# Altium schematic sheet TMC5161_StepperDriver.SchDoc
size Letter
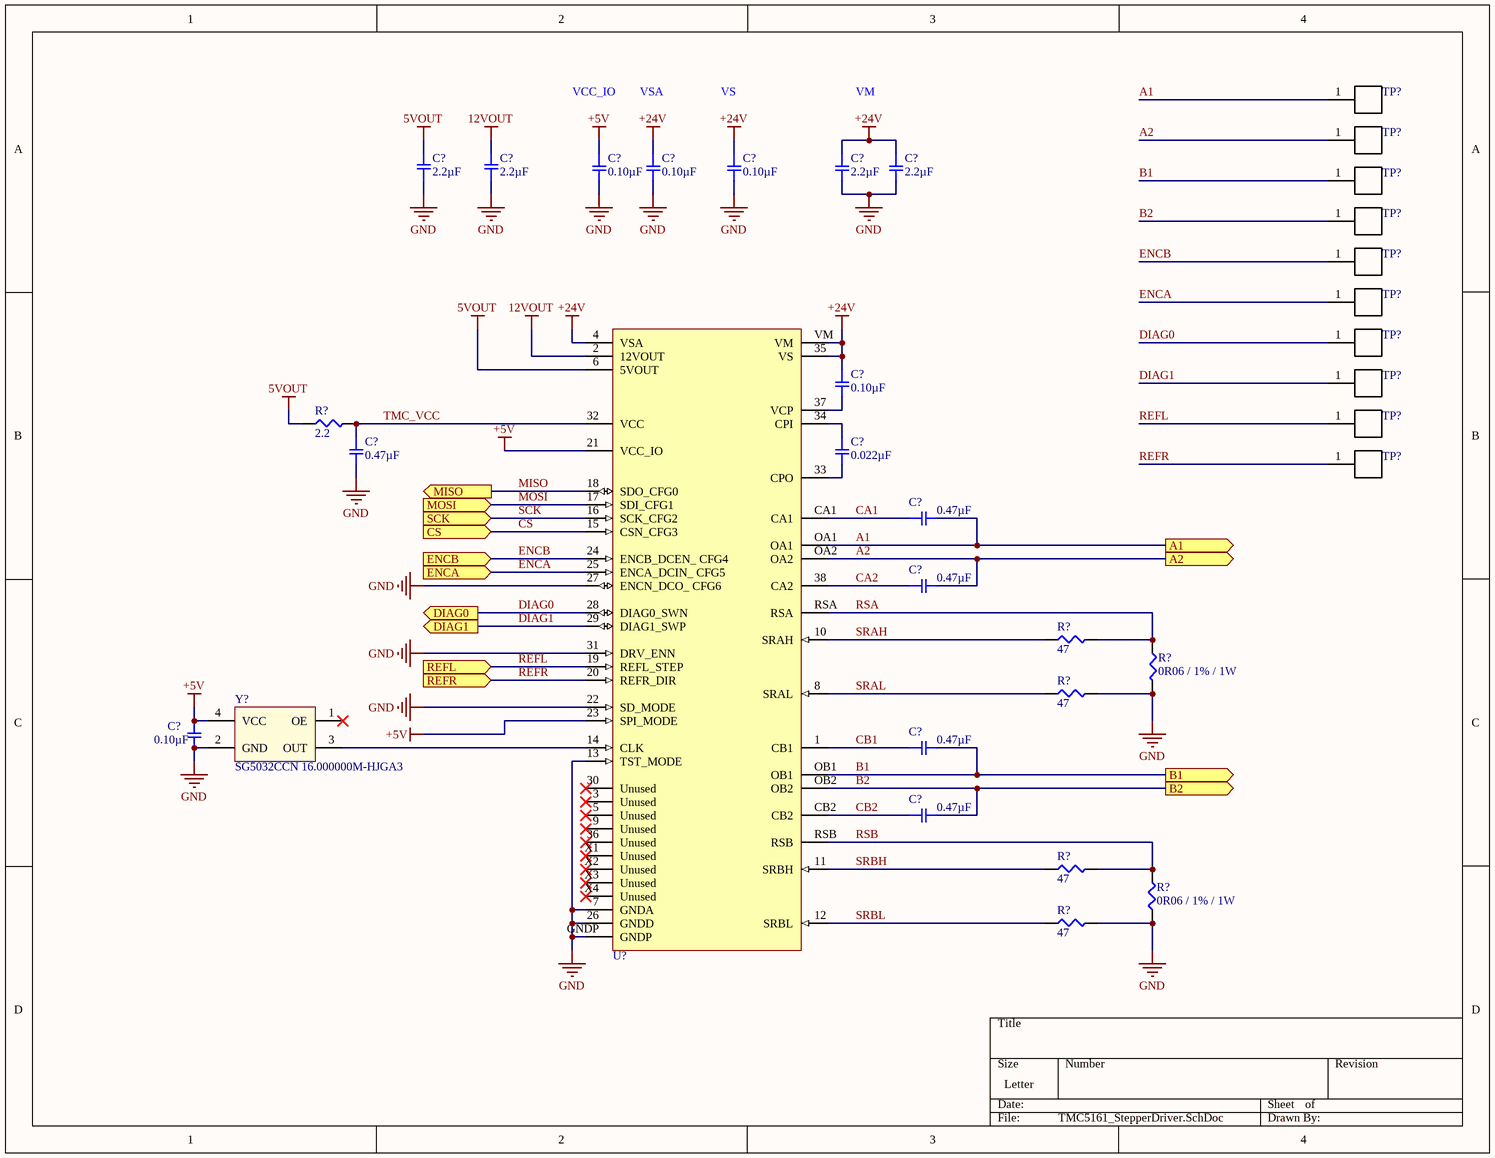
[diagram p0: TMC5161_StepperDriver.SchDoc]

## Parts
(Parts that share a designator on the sheet are numbered #1, #2 ... from top to bottom, then left to right.)
C?#1  2.2µF  [SMD-0603C]
C?#2  2.2µF  [SMD-0603C]
C?#3  0.10µF  [SMD-0603C]
C?#4  0.10µF  [SMD-0603C]
C?#5  0.10µF  [SMD-0603C]
C?#6  2.2µF  [SMD-0805C]
C?#7  2.2µF  [SMD-0805C]
C?#8  0.10µF  [SMD-0603C]
C?#9  0.47µF  [SMD-0603C]
C?#10  0.022µF  [SMD-0603C]
C?#11  0.47µF  [SMD-0603C]
C?#12  0.47µF  [SMD-0603C]
C?#13  0.10µF  [SMD-0603C]
C?#14  0.47µF  [SMD-0603C]
C?#15  0.47µF  [SMD-0603C]
R?#1  2.2  [SMD-0603-RES]
R?#2  47  [SMD-0603-RES]
R?#3  0R06 / 1% / 1W  [Resistor_2512]
R?#4  47  [SMD-0603-RES]
R?#5  47  [SMD-0603-RES]
R?#6  0R06 / 1% / 1W  [Resistor_2512]
R?#7  47  [SMD-0603-RES]
TP?#1  A1  [TE_RCU-0C]  (value not drawn)
TP?#2  A2  [TE_RCU-0C]  (value not drawn)
TP?#3  B1  [TE_RCU-0C]  (value not drawn)
TP?#4  B2  [TE_RCU-0C]  (value not drawn)
TP?#5  ENCB  [TE_RCU-0C]  (value not drawn)
TP?#6  ENCA  [TE_RCU-0C]  (value not drawn)
TP?#7  DIAG0  [TE_RCU-0C]  (value not drawn)
TP?#8  DIAG1  [TE_RCU-0C]  (value not drawn)
TP?#9  REFL  [TE_RCU-0C]  (value not drawn)
TP?#10  REFR  [TE_RCU-0C]  (value not drawn)
U?  TMC5161  [TMC5161-HH]  (value not drawn)
Y?  SG5032CCN 16.000000M-HJGA3  [SG5032CCN_16.000000M-HJGA3]

## Ports
A1 (out), A2 (out), B1 (out), B2 (out), CS (in), DIAG0 (out), DIAG1 (out), ENCA (in), ENCB (in), MISO (out), MOSI (in), REFL (in), REFR (in), SCK (in)

## Nets
5VOUT: C?#1.2 R?#1.1 U?.6(5VOUT)
12VOUT: C?#2.2 U?.2(12VOUT)
+5V: C?#3.1 C?#13.1 U?.21(VCC_IO) U?.23(SPI_MODE) Y?.4(VCC)
+24V: C?#4.1 C?#5.1 C?#6.1 C?#7.1 C?#8.1 U?.4(VSA) U?.35(VS) U?.VM
GND: C?#1.1 C?#2.1 C?#3.2 C?#4.2 C?#5.2 C?#6.2 C?#7.2 C?#9.2 C?#13.2 R?#3.2 R?#4.2 R?#6.1 R?#7.2 U?.7(GNDA) U?.13(TST_MODE) U?.22(SD_MODE) U?.26(GNDD) U?.27(ENCN_DCO__CFG6) U?.31(DRV_ENN) U?.GNDP Y?.2(GND)
A1: C?#11.2 TP?#1.1 U?.OA1 ; port A1
A2: C?#12.2 TP?#2.1 U?.OA2 ; port A2
B1: C?#14.2 TP?#3.1 U?.OB1 ; port B1
B2: C?#15.2 TP?#4.1 U?.OB2 ; port B2
CA1: C?#11.1 U?.CA1
CA2: C?#12.1 U?.38(CA2)
CB1: C?#14.1 U?.1(CB1)
CB2: C?#15.1 U?.CB2
CS: U?.15(CSN_CFG3) ; port CS
DIAG0: TP?#7.1 U?.28(DIAG0_SWN) ; port DIAG0
DIAG1: TP?#8.1 U?.29(DIAG1_SWP) ; port DIAG1
ENCA: TP?#6.1 U?.25(ENCA_DCIN__CFG5) ; port ENCA
ENCB: TP?#5.1 U?.24(ENCB_DCEN__CFG4) ; port ENCB
MISO: U?.18(SDO_CFG0) ; port MISO
MOSI: U?.17(SDI_CFG1) ; port MOSI
REFL: TP?#9.1 U?.19(REFL_STEP) ; port REFL
REFR: TP?#10.1 U?.20(REFR_DIR) ; port REFR
RSA: R?#2.2 R?#3.1 U?.RSA
RSB: R?#5.2 R?#6.2 U?.RSB
SCK: U?.16(SCK_CFG2) ; port SCK
SRAH: R?#2.1 U?.10(SRAH)
SRAL: R?#4.1 U?.8(SRAL)
SRBH: R?#5.1 U?.11(SRBH)
SRBL: R?#7.1 U?.12(SRBL)
TMC_VCC: C?#9.1 R?#1.2 U?.32(VCC)
NetC?#8_2: C?#8.2 U?.37(VCP)
NetC?#10_1: C?#10.1 U?.34(CPI)
NetC?#10_2: C?#10.2 U?.33(CPO)
NetU?_14: U?.14(CLK) Y?.3(OUT)

Not connected (* = marked no-connect by the designer): U? 3(Unused)* 5(Unused)* 9(Unused)* 30(Unused)* 36(Unused)* X1(Unused)* X2(Unused)* X3(Unused)* X4(Unused)*; Y? 1(OE)*

## Notes on the sheet
- VCC_IO
- VSA
- VS
- VM

## Library data of the parts
C?#1 C?#2 = GRM188C71E225KE11D: CAP CER 2.2UF 25V X7S 0603; Manufacturer: Murata Electronics North America; Factory Stock: 0; Unit Price (USD): 0.25; Minimum Quantity: 1; Tolerance: ±10%; Datasheets: http://www.murata.com/~/media/webrenewal/support/library/catalog/products/capacitor/mlcc/c02e.pdf; Image: //media.digikey.com/Renders/Murata%20Renders/ZRB-SERIES-0402.jpg; Digi-Key Part Number: 490-12732-1-ND; Part Number: GRM188C71E225KE11D; Quantity Available: 14750; @ qty: 0; Packaging: Cut Tape (CT); Series: GRM; Part Status: Active; Value: 2.2µF; Voltage: 25V; Temperature Coefficient: X7S; Operating Temperature: -55°C ~ 125°C; Features: -; Ratings: -; Applications: General Purpose; Mounting Type: Surface Mount, MLCC; Package / Case: 0603 (1608 Metric); Size / Dimension: 0.063" L x 0.031" W (1.60mm x 0.80mm); Height - Seated (Max): -; Thickness (Max): 0.039" (1.00mm); Lead Spacing: -; Lead Style: -
C?#3-C?#5 C?#8 C?#13 = GCJ188R71H104KA12D: CAP CER 0.1UF 50V X7R 0603; Manufacturer: Murata Electronics North America; Factory Stock: 0; Unit Price (USD): 0.12; Minimum Quantity: 1; Tolerance: ±10%; Datasheets: http://www.murata.com/~/media/webrenewal/support/library/catalog/products/capacitor/mlcc/c03e.ashx; Image: //media.digikey.com/Renders/Murata%20Renders/0603%28LQG18%29.jpg; Digi-Key Part Number: 490-5798-1-ND; Part Number: GCJ188R71H104KA12D; Quantity Available: 163695; @ qty: 0; Packaging: Cut Tape (CT); Series: GCJ; Part Status: Active; Value: 0.10µF; Voltage: 50V; Temperature Coefficient: X7R; Operating Temperature: -55°C ~ 125°C; Features: Soft Termination; Ratings: AEC-Q200; Applications: Automotive, Boardflex Sensitive; Mounting Type: Surface Mount, MLCC; Package / Case: 0603 (1608 Metric); Size / Dimension: 0.063" L x 0.031" W (1.60mm x 0.80mm); Height - Seated (Max): -; Thickness (Max): 0.035" (0.90mm); Lead Spacing: -; Lead Style: -
C?#6 C?#7 = GRM21BR61H225KA73L: CAP CER 2.2UF 50V X5R 0805; Manufacturer: Murata Electronics North America; Factory Stock: 0; Unit Price (USD): 0.29; Minimum Quantity: 1; Tolerance: ±10%; Datasheets: http://www.murata.com/~/media/webrenewal/support/library/catalog/products/capacitor/mlcc/c02e.pdf; Image: //media.digikey.com/Renders/Murata%20Renders/0805%20(2012%20Metric)%20.85mm.jpg; Digi-Key Part Number: 490-10750-1-ND; Part Number: GRM21BR61H225KA73L; Quantity Available: 36370; @ qty: 0; Packaging: Cut Tape (CT); Series: GRM; Part Status: Active; Value: 2.2µF; Voltage: 50V; Temperature Coefficient: X5R; Operating Temperature: -55°C ~ 85°C; Features: -; Ratings: -; Applications: General Purpose; Mounting Type: Surface Mount, MLCC; Package / Case: 0805 (2012 Metric); Size / Dimension: 0.079" L x 0.049" W (2.00mm x 1.25mm); Height - Seated (Max): -; Thickness (Max): 0.055" (1.40mm); Lead Spacing: -; Lead Style: -
C?#9 C?#11 C?#12 C?#14 C?#15 = GCJ188R71C474KA12D: CAP CER 0.47UF 16V X7R 0603; Manufacturer: Murata Electronics North America; Factory Stock: 0; Unit Price (USD): 0.18; Minimum Quantity: 1; Tolerance: ±10%; Datasheets: http://www.murata.com/~/media/webrenewal/support/library/catalog/products/capacitor/mlcc/c03e.ashx; Image: //media.digikey.com/Renders/Murata%20Renders/0603%28LQG18%29.jpg; Digi-Key Part Number: 490-5812-1-ND; Part Number: GCJ188R71C474KA12D; Quantity Available: 26222; @ qty: 0; Packaging: Cut Tape (CT); Series: GCJ; Part Status: Active; Value: 0.47µF; Voltage: 16V; Temperature Coefficient: X7R; Operating Temperature: -55°C ~ 125°C; Features: Soft Termination; Ratings: AEC-Q200; Applications: Automotive, Boardflex Sensitive; Mounting Type: Surface Mount, MLCC; Package / Case: 0603 (1608 Metric); Size / Dimension: 0.063" L x 0.031" W (1.60mm x 0.80mm); Height - Seated (Max): -; Thickness (Max): 0.031" (0.80mm); Lead Spacing: -; Lead Style: -
C?#10 = GCJ188R71H223KA01D: CAP CER 0.022UF 50V X7R 0603; Manufacturer: Murata Electronics North America; Factory Stock: 0; Unit Price (USD): 0.22; Minimum Quantity: 1; Tolerance: ±10%; Datasheets: http://www.murata.com/~/media/webrenewal/support/library/catalog/products/capacitor/mlcc/c03e.ashx; Image: //media.digikey.com/Renders/Murata%20Renders/0603%28LQG18%29.jpg; Digi-Key Part Number: 490-5851-1-ND; Part Number: GCJ188R71H223KA01D; Quantity Available: 7651; @ qty: 0; Packaging: Cut Tape (CT); Series: GCJ; Part Status: Active; Value: 0.022µF; Voltage: 50V; Temperature Coefficient: X7R; Operating Temperature: -55°C ~ 125°C; Features: Soft Termination; Ratings: AEC-Q200; Applications: Automotive, Boardflex Sensitive; Mounting Type: Surface Mount, MLCC; Package / Case: 0603 (1608 Metric); Size / Dimension: 0.063" L x 0.031" W (1.60mm x 0.80mm); Height - Seated (Max): -; Thickness (Max): 0.031" (0.80mm); Lead Spacing: -; Lead Style: -
R?#1 = ERJ-3GEYJ2R2V: RES SMD 2.2 OHM 5% 1/10W 0603; Manufacturer: Panasonic Electronic Components; Factory Stock: 0; Unit Price (USD): 0.00321; @ qty: 1500; Minimum Quantity: 1; Power (Watts): 0.1W, 1/10W; Temperature Coefficient: -100/ +600ppm/°C; Part Number: ERJ-3GEYJ2R2V; Datasheets: http://industrial.panasonic.com/www-cgi/jvcr13pz.cgi?E+PZ+3+AOA0001+ERJ3GEYJ2R2V+7+WW; Image: //media.digikey.com/Photos/Panasonic%20Photos/MFG_ERJ-P6W%20Series.jpg; Digi-Key Part Number: P2.2GCT-ND; Quantity Available: 416577; Packaging: Cut Tape (CT); Series: ERJ; Part Status: Active; Value: 2.2; Tolerance: ±5%; Composition: Thick Film; Features: Automotive AEC-Q200; Operating Temperature: -55°C ~ 155°C; Package / Case: 0603 (1608 Metric); Supplier Device Package: 0603; Size / Dimension: 0.063" L x 0.031" W (1.60mm x 0.80mm); Height - Seated (Max): 0.022" (0.55mm); Number of Terminations: 2; Failure Rate: -
R?#2 R?#4 R?#5 R?#7 = ERJ-3EKF47R0V: RES SMD 47 OHM 1% 1/10W 0603; Manufacturer: Panasonic Electronic Components; Factory Stock: 0; Unit Price (USD): 0.00379; @ qty: 1500; Minimum Quantity: 1; Power (Watts): 0.1W, 1/10W; Temperature Coefficient: ±100ppm/°C; Part Number: ERJ-3EKF47R0V; Datasheets: http://industrial.panasonic.com/www-cgi/jvcr13pz.cgi?E+PZ+3+AOA0002+ERJ3EKF47R0V+7+WW; Image: //media.digikey.com/Photos/Panasonic%20Photos/MFG_ERJ-P6W%20Series.jpg; Digi-Key Part Number: P47.0HCT-ND; Quantity Available: 175738; Packaging: Cut Tape (CT); Series: ERJ; Part Status: Active; Value: 47; Tolerance: ±1%; Composition: Thick Film; Features: Automotive AEC-Q200; Operating Temperature: -55°C ~ 155°C; Package / Case: 0603 (1608 Metric); Supplier Device Package: 0603; Size / Dimension: 0.063" L x 0.031" W (1.60mm x 0.80mm); Height - Seated (Max): 0.022" (0.55mm); Number of Terminations: 2; Failure Rate: -
R?#3 R?#6 = Resistor 2512
TP?#1-TP?#10 = RCU-0C: 0603 PROBE PAD; Power_Rating: 0 W; Resistance: <.05; MF: TE Connectivity; Tolerance: 0%; Digi-Key_Part_Number: A106145CT-ND; EU_RoHS_Compliance: Compliant; Digi-Key_Purchase_URL: https://www.digikey.com/product-detail/en/te-connectivity-amp-connectors/RCU-0C/A106145CT-ND/3477802?utm_source=snapeda&utm_medium=aggregator&utm_campaign=symbol; SnapEDA_Link: https://www.snapeda.com/parts/RCU-0C/TE%20Connectivity%20AMP%20Connectors/view-part/?ref=snap; Link: http://www.te.com/usa-en/product-1625854-3.html; MP: RCU-0C; Package: 0603; Value: *
U? = TMC5161: STEPPER MOTOR CTLR/DVR SPI / Manufacturer PN: TMC5161-AA-T
Y? = SG5032CCN 16.000000M-HJGA3: XTAL OSC XO 16.0000MHZ CMOS SMD / Manufacturer PN: SG5032CCN 16.000000M-HJGA3